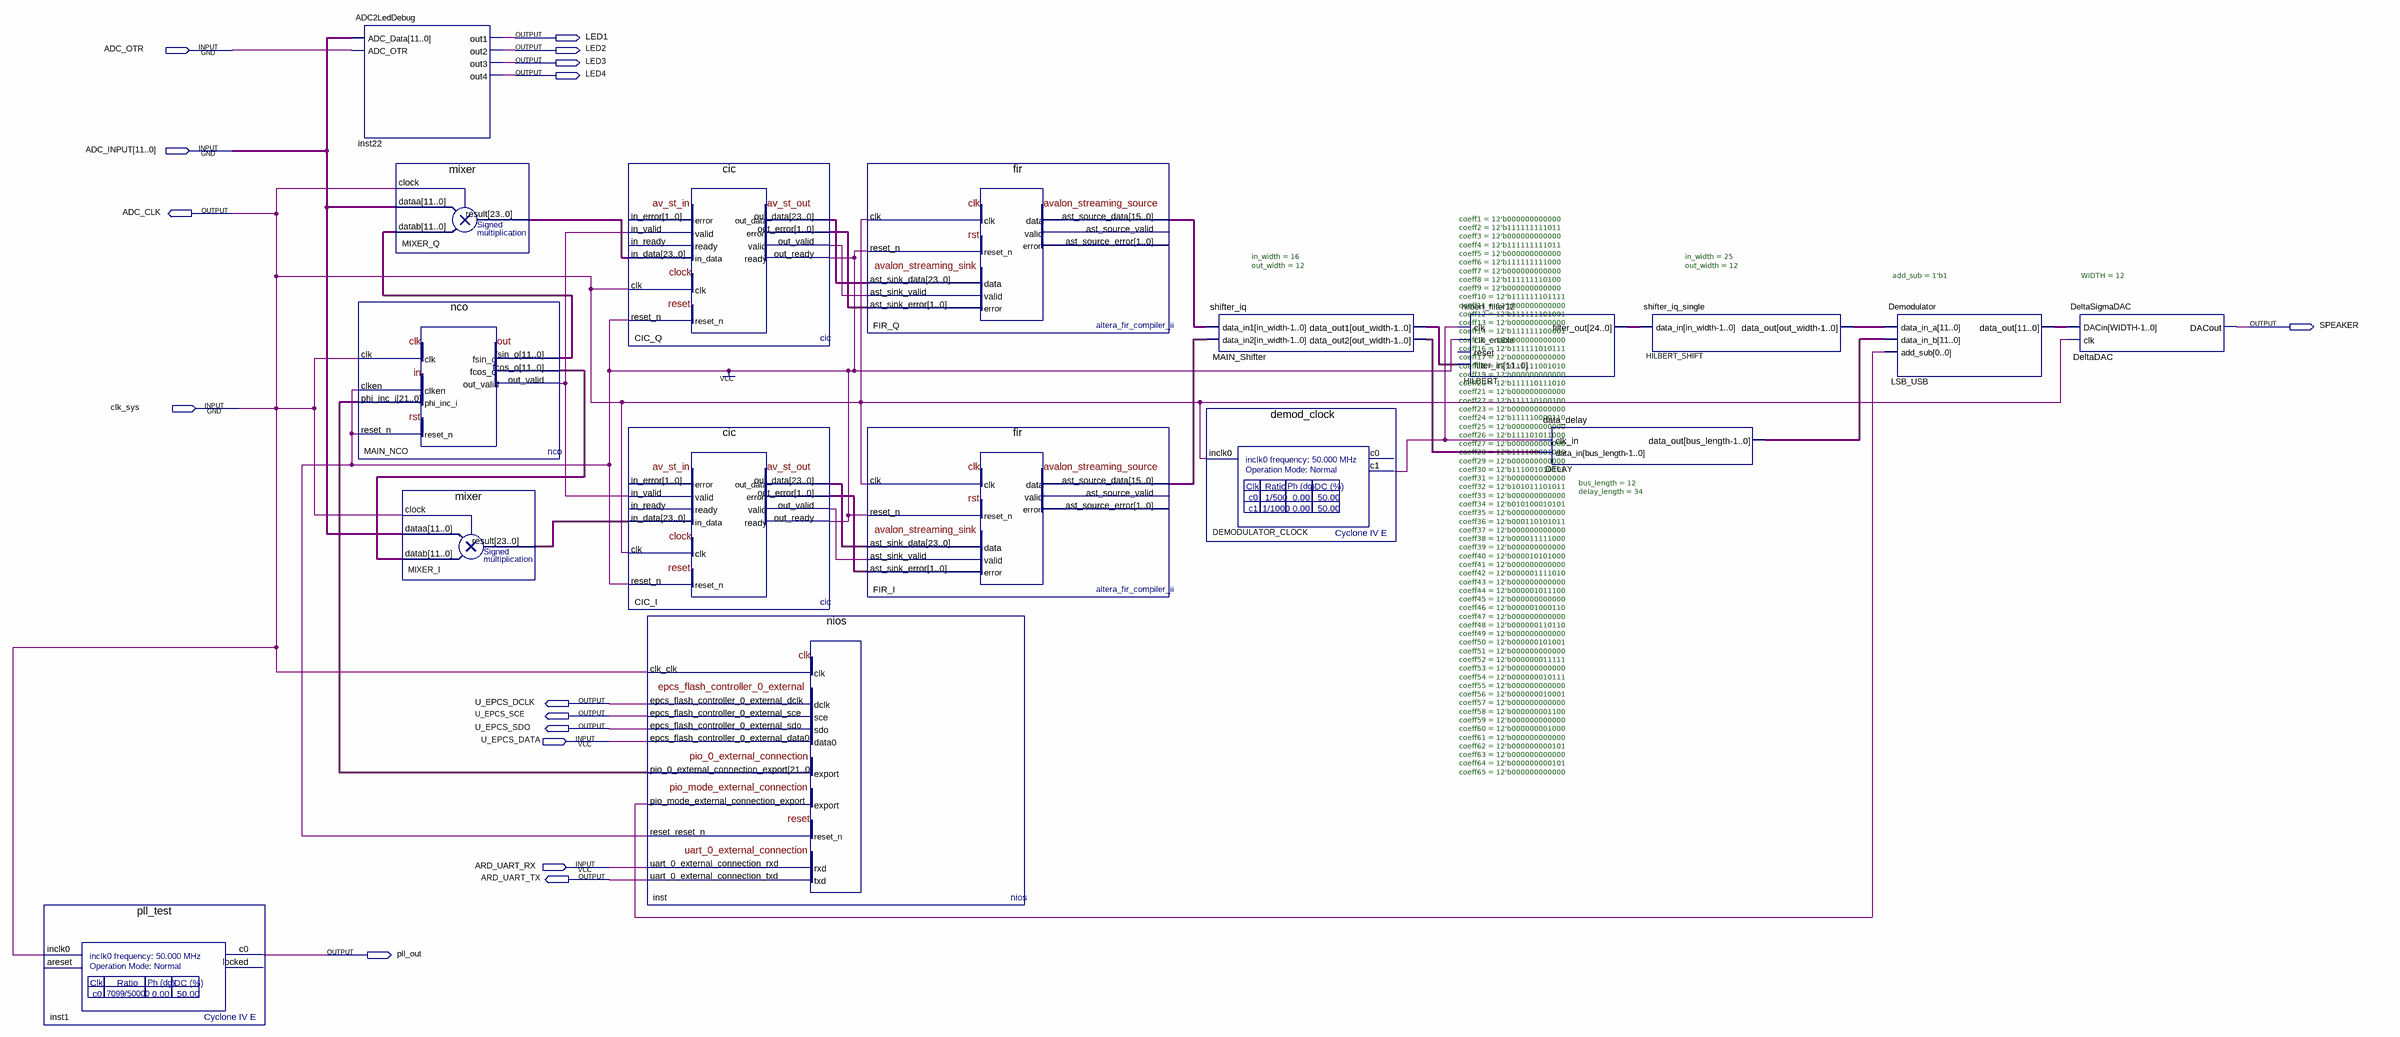
[diagram p0: schematic sheet]
// Quartus schematic UA3REO.bdf as structural Verilog: 17 symbols, 16 pins
module UA3REO (
  input  ADC_OTR,
  input  [11:0] ADC_INPUT,
  input  clk_sys,
  input  U_EPCS_DATA,
  input  ARD_UART_RX,
  output LED1,
  output LED2,
  output LED3,
  output LED4,
  output ADC_CLK,
  output SPEAKER,
  output U_EPCS_DCLK,
  output U_EPCS_SCE,
  output U_EPCS_SDO,
  output ARD_UART_TX,
  output pll_out
);

  wire CIC_I_out_valid, CIC_Q_out_valid, DEMODULATOR_CLOCK_c1, inst_pio_mode_external_connection_export,
       MAIN_NCO_out_valid;
  wire [1:0] CIC_I_out_error, CIC_Q_out_error;
  wire [11:0] DELAY_data_out, HILBERT_SHIFT_data_out, LSB_USB_data_out, MAIN_NCO_fcos_o, MAIN_NCO_fsin_o,
       MAIN_Shifter_data_out1, MAIN_Shifter_data_out2;
  wire [15:0] FIR_I_ast_source_data, FIR_Q_ast_source_data;
  wire [21:0] inst_pio_0_external_connection_export;
  wire [23:0] CIC_I_out_data, CIC_Q_out_data, MIXER_I_result, MIXER_Q_result;
  wire [24:0] HILBERT_filter_out;

  pll_test inst1 (.inclk0(clk_sys), .c0(pll_out));  // open: areset, locked
  ADC2LedDebug inst22 (.ADC_Data(ADC_INPUT), .ADC_OTR(ADC_OTR), .out1(LED1), .out2(LED2), .out3(LED3), .out4(LED4));
  nco MAIN_NCO (
    .clk(clk_sys), .clken(1'b1), .phi_inc_i(inst_pio_0_external_connection_export), .reset_n(1'b1),
    .fsin_o(MAIN_NCO_fsin_o), .fcos_o(MAIN_NCO_fcos_o), .out_valid(MAIN_NCO_out_valid));
  mixer MIXER_Q (.clock(clk_sys), .dataa(ADC_INPUT), .datab(MAIN_NCO_fsin_o), .result(MIXER_Q_result));
  mixer MIXER_I (.clock(clk_sys), .dataa(ADC_INPUT), .datab(MAIN_NCO_fcos_o), .result(MIXER_I_result));
  cic CIC_Q (
    .in_valid(MAIN_NCO_out_valid), .in_data(MIXER_Q_result), .out_ready(1'b1), .clk(clk_sys), .reset_n(1'b1),
    .out_data(CIC_Q_out_data), .out_error(CIC_Q_out_error), .out_valid(CIC_Q_out_valid));  // open: in_error, in_ready
  cic CIC_I (
    .in_valid(MAIN_NCO_out_valid), .in_data(MIXER_I_result), .out_ready(1'b1), .clk(clk_sys), .reset_n(1'b1),
    .out_data(CIC_I_out_data), .out_error(CIC_I_out_error), .out_valid(CIC_I_out_valid));  // open: in_error, in_ready
  nios inst (
    .clk_clk(clk_sys), .epcs_flash_controller_0_external_data0(U_EPCS_DATA), .reset_reset_n(1'b1),
    .uart_0_external_connection_rxd(ARD_UART_RX), .epcs_flash_controller_0_external_dclk(U_EPCS_DCLK),
    .epcs_flash_controller_0_external_sce(U_EPCS_SCE), .epcs_flash_controller_0_external_sdo(U_EPCS_SDO),
    .pio_0_external_connection_export(inst_pio_0_external_connection_export),
    .pio_mode_external_connection_export(inst_pio_mode_external_connection_export),
    .uart_0_external_connection_txd(ARD_UART_TX));
  fir FIR_Q (
    .clk(clk_sys), .reset_n(1'b1), .ast_sink_data(CIC_Q_out_data), .ast_sink_valid(CIC_Q_out_valid),
    .ast_sink_error(CIC_Q_out_error), .ast_source_data(FIR_Q_ast_source_data));  // open: ast_source_valid, ast_source_error
  fir FIR_I (
    .clk(clk_sys), .reset_n(1'b1), .ast_sink_data(CIC_I_out_data), .ast_sink_valid(CIC_I_out_valid),
    .ast_sink_error(CIC_I_out_error), .ast_source_data(FIR_I_ast_source_data));  // open: ast_source_valid, ast_source_error
  shifter_iq #(.in_width(16), .out_width(12)) MAIN_Shifter (
    .data_in1(FIR_Q_ast_source_data), .data_in2(FIR_I_ast_source_data), .data_out1(MAIN_Shifter_data_out1),
    .data_out2(MAIN_Shifter_data_out2));
  demod_clock DEMODULATOR_CLOCK (.inclk0(clk_sys), .c1(DEMODULATOR_CLOCK_c1));  // open: c0
  hilbert_filter12 #(.coeff1(12'b000000000000), .coeff2(12'b111111111011), .coeff3(12'b000000000000), .coeff4(12'b111111111011), .coeff5(12'b000000000000), .coeff6(12'b111111111000), .coeff7(12'b000000000000), .coeff8(12'b111111110100), .coeff9(12'b000000000000), .coeff10(12'b111111101111), .coeff11(12'b000000000000), .coeff12(12'b111111101001), .coeff13(12'b000000000000), .coeff14(12'b111111100001), .coeff15(12'b000000000000), .coeff16(12'b111111010111), .coeff17(12'b000000000000), .coeff18(12'b111111001010), .coeff19(12'b000000000000), .coeff20(12'b111110111010), .coeff21(12'b000000000000), .coeff22(12'b111110100100), .coeff23(12'b000000000000), .coeff24(12'b111110000110), .coeff25(12'b000000000000), .coeff26(12'b111101011000), .coeff27(12'b000000000000), .coeff28(12'b111100001000), .coeff29(12'b000000000000), .coeff30(12'b111001010101), .coeff31(12'b000000000000), .coeff32(12'b101011101011), .coeff33(12'b000000000000), .coeff34(12'b010100010101), .coeff35(12'b000000000000), .coeff36(12'b000110101011), .coeff37(12'b000000000000), .coeff38(12'b000011111000), .coeff39(12'b000000000000), .coeff40(12'b000010101000), .coeff41(12'b000000000000), .coeff42(12'b000001111010), .coeff43(12'b000000000000), .coeff44(12'b000001011100), .coeff45(12'b000000000000), .coeff46(12'b000001000110), .coeff47(12'b000000000000), .coeff48(12'b000000110110), .coeff49(12'b000000000000), .coeff50(12'b000000101001), .coeff51(12'b000000000000), .coeff52(12'b000000011111), .coeff53(12'b000000000000), .coeff54(12'b000000010111), .coeff55(12'b000000000000), .coeff56(12'b000000010001), .coeff57(12'b000000000000), .coeff58(12'b000000001100), .coeff59(12'b000000000000), .coeff60(12'b000000001000), .coeff61(12'b000000000000), .coeff62(12'b000000000101), .coeff63(12'b000000000000), .coeff64(12'b000000000101), .coeff65(12'b000000000000)) HILBERT (
    .clk(DEMODULATOR_CLOCK_c1), .clk_enable(1'b1), .filter_in(MAIN_Shifter_data_out1),
    .filter_out(HILBERT_filter_out));  // open: reset
  data_delay #(.bus_length(12), .delay_length(34)) DELAY (
    .clk_in(DEMODULATOR_CLOCK_c1), .data_in(MAIN_Shifter_data_out2), .data_out(DELAY_data_out));
  shifter_iq_single #(.in_width(25), .out_width(12)) HILBERT_SHIFT (
    .data_in(HILBERT_filter_out), .data_out(HILBERT_SHIFT_data_out));
  Demodulator #(.add_sub(1'b1)) LSB_USB (
    .data_in_a(HILBERT_SHIFT_data_out), .data_in_b(DELAY_data_out),
    .add_sub(inst_pio_mode_external_connection_export), .data_out(LSB_USB_data_out));
  DeltaSigmaDAC #(.WIDTH(12)) DeltaDAC (.DACin(LSB_USB_data_out), .clk(clk_sys), .DACout(SPEAKER));

  assign ADC_CLK = clk_sys;
endmodule
